# Altium schematic sheet leg_module.SchDoc: Leg module
size A4; Organization: GPA Robotics; DocumentNumber: 9; Revision: REV 0; SheetNumber: 9; SheetTotal: 11
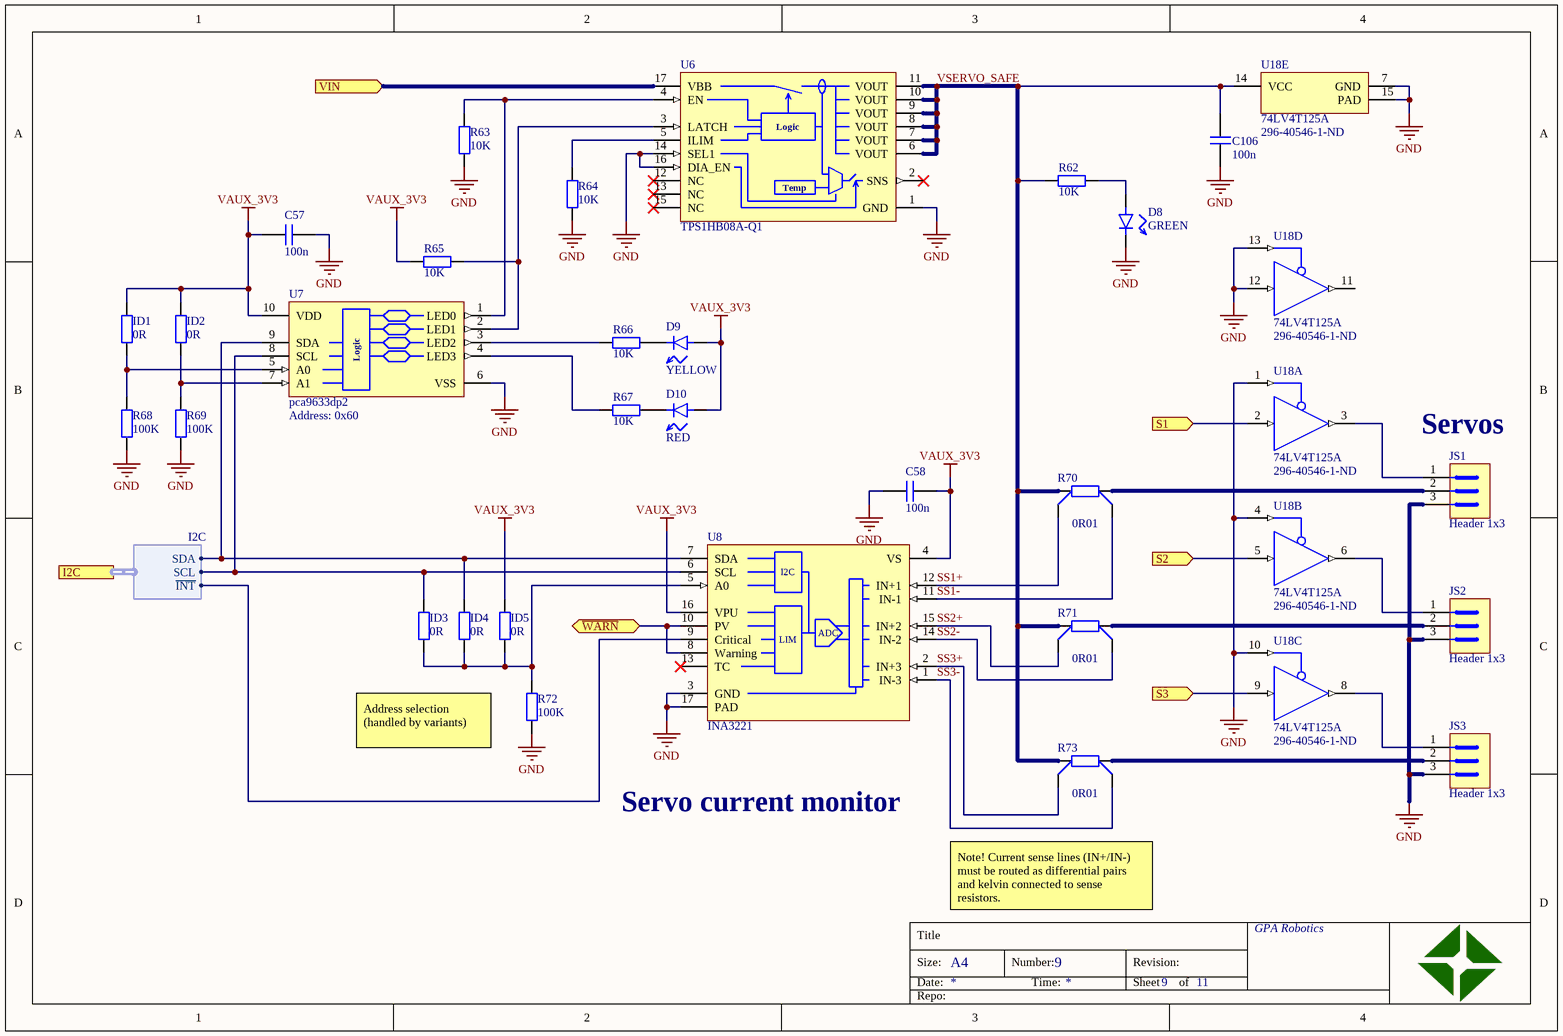
[diagram p0: leg_module.SchDoc]

## Parts
C57  value 100n  [CAPC1005X06N]  (hidden comment: cap)
C58  value 100n  [CAPC1005X06N]  (hidden comment: cap)
C106  value 100n  [CAPC1005X06N]  (hidden comment: cap)
D8  value GREEN  [CAPCP1005X06N]  (hidden comment: led)
D9  value YELLOW  [CAPCP1005X06N]  (hidden comment: led)
D10  value RED  [CAPCP1005X06N]  (hidden comment: led)
ID1  value 0R  [RESC1005X04N]  (hidden comment: res)
ID2  value 0R  [RESC1005X04N]  (hidden comment: res)
ID3  value 0R  [RESC1005X04N]  (hidden comment: res)
ID4  value 0R  [RESC1005X04N]  (hidden comment: res)
ID5  value 0R  [RESC1005X04N]  (hidden comment: res)
JS1  Header 1x3  [HEADER_1x3_100MIL]
JS2  Header 1x3  [HEADER_1x3_100MIL]
JS3  Header 1x3  [HEADER_1x3_100MIL]
R62  value 10K  [RESC1005X04N]  (hidden comment: res)
R63  value 10K  [RESC1005X04N]  (hidden comment: res)
R64  value 10K  [RESC1005X04N]  (hidden comment: res)
R65  value 10K  [RESC1005X04N]  (hidden comment: res)
R66  value 10K  [RESC1005X04N]  (hidden comment: res)
R67  value 10K  [RESC1005X04N]  (hidden comment: res)
R68  value 100K  [RESC1005X04N]  (hidden comment: res)
R69  value 100K  [RESC1005X04N]  (hidden comment: res)
R70  value 0R01  [4T_RESC1632X05N]  (hidden comment: res_4t)
R71  value 0R01  [4T_RESC1632X05N]  (hidden comment: res_4t)
R72  value 100K  [RESC1005X04N]  (hidden comment: res)
R73  value 0R01  [4T_RESC1632X05N]  (hidden comment: res_4t)
U6  TPS1HB08A-Q1  [TSOP65P640X120_HS-17N_TPS1HB08]
U7  pca9633dp2  Address: 0x60  [TSSOP50P490X110-10N_PCA9633DP2]
U8  INA3221  [QFN65P400X400X100_HS-17N_INA3221]
U18  74LV4T125A  Supplier Part Number 1: 296-40546-1-ND  [QFN50P350X350X100_HS-15N]  (parts A,B,C,D,E of 5)

## Ports
I2C (harness I2C), S1 (in), S2 (in), S3 (in), VIN (in), ~{WARN} (bidir)

## Harnesses
I2C: SDA, SCL, ~{INT}

## Nets
GND: C57.1 C58.1 C106.1 D8.C JS1.3 JS2.3 JS3.3 R63.1 R64.1 R68.1 R69.1 R72.1 U6.1(GND) U6.14(SEL1) U6.16(DIA_EN) U7.6(VSS) U8.3(GND) U8.17(PAD) U18.1(1OE) U18.4(2OE) U18.7(GND) U18.10(3OE) U18.12(4A) U18.13(4OE) U18.15(PAD)
VAUX_3V3: C57.2 C58.2 D9.A D10.A ID1.2 ID2.2 ID5.2 R65.1 U7.10(VDD) U8.4(VS) U8.16(VPU)
~{WARN}: U8.8(Warning) U8.10(PV) ; port ~{WARN}
S1: U18.2(1A) ; port S1
S2: U18.5(2A) ; port S2
S3: U18.9(3A) ; port S3
SS1+: R70.3 U8.12(IN+1)
SS1-: R70.4 U8.11(IN-1)
SS2+: R71.3 U8.15(IN+2)
SS2-: R71.4 U8.14(IN-2)
SS3+: R73.3 U8.2(IN+3)
SS3-: R73.4 U8.1(IN-3)
VIN: U6.17(VBB) ; port VIN
VSERVO_SAFE: C106.2 R62.1 R70.1 R71.1 R73.1 U6.6(VOUT) U6.7(VOUT) U6.8(VOUT) U6.9(VOUT) U6.10(VOUT) U6.11(VOUT) U18.14(VCC)
NetD8_A: D8.A R62.2
NetD9_C: D9.C R66.1
NetD10_C: D10.C R67.1
NetID1_1: ID1.1 R68.2 U7.5(A0)
NetID2_1: ID2.1 R69.2 U7.7(A1)
NetID3_1: ID3.1 ID4.1 ID5.1 R72.2 U8.5(A0)
NetID3_2: ID3.2 U7.8(SCL) U8.6(SCL) ; port I2C.SCL
NetID4_2: ID4.2 U7.9(SDA) U8.7(SDA) ; port I2C.SDA
NetJS1_1: JS1.1 U18.3(1Y)
NetJS1_2: JS1.2 R70.2
NetJS2_1: JS2.1 U18.6(2Y)
NetJS2_2: JS2.2 R71.2
NetJS3_1: JS3.1 U18.8(3Y)
NetJS3_2: JS3.2 R73.2
NetR63_2: R63.2 U6.4(EN) U7.1(LED0)
NetR64_2: R64.2 U6.5(ILIM)
NetR65_2: R65.2 U6.3(LATCH) U7.2(LED1)
NetR66_2: R66.2 U7.3(LED2)
NetR67_2: R67.2 U7.4(LED3)
NetU8_9: U8.9(Critical) ; port I2C.~{INT}

Not connected (* = marked no-connect by the designer): U6 2(SNS)* 12(NC)* 13(NC)* 15(NC)*; U8 13(TC)*; U18 11(4Y)

## Notes on the sheet
- (near JS1) Servos
- Address selection
  (handled by variants)
- Servo current monitor
- Note! Current sense lines (IN+/IN-) must be routed as differential pairs and kelvin connected to sense resistors.
- Title
- Size:
- Date:
- A4
- Number:
- Time:
- Revision:
- Sheet
- of
- Repo:
- (in symbol ina3221) I2C; ADC; LIM
- (in symbol pca9633dp2) Logic
- (in symbol tps1hb08a) Logic; Temp

## Library data of the parts
C57 C58 C106 = cap: Capacitor; voltage: *; type: *; #digikey: *; #mouser: *
D8-D10 = led: pin to pad: A>1 C>2
ID1-ID5 R62-R69 R72 = res: Resistor; power: *; voltage: *; #digikey: *; #mouser: *
JS1-JS3 = header_1x3_100mil: 2.54mm pitch single row header
R70 R71 R73 = res_4t: Resistor; power: *; #digikey: *; #mouser: *
U6 = tps1hb08a: 40-V, 8-mΩ Single-Channel Smart High-Side Switch; ComponentLink1Description: datasheet; ComponentLink1URL: http://www.ti.com/lit/ds/symlink/tps1hb08-q1.pdf
U7 = pca9633dp2: 4-bit Fm+ I2C-bus LED driver; ComponentLink1Description: datasheet; ComponentLink1URL: https://www.nxp.com/docs/en/data-sheet/PCA9633.pdf?
U8 = ina3221: Triple-Channel, High-Side Measurement. Shunt and Bus Voltage Monitor with I 2 C- and SMBUS-Compatible Interface; ComponentLink1Description: datasheet; ComponentLink1URL: http://www.ti.com/lit/ds/sbos576b/sbos576b.pdf
U18 = sn74lv4t125a: Quadruple Bus Buffer Gates With 3-State Outputs; #digikey: *; #mouser: *; ComponentLink1Description: Datasheet; ComponentLink1URL: http://www.ti.com/lit/ds/symlink/sn74lv125a.pdf; Supplier 1: Digi-Key